# Altium project Project Sunsat PCB.PrjPcb
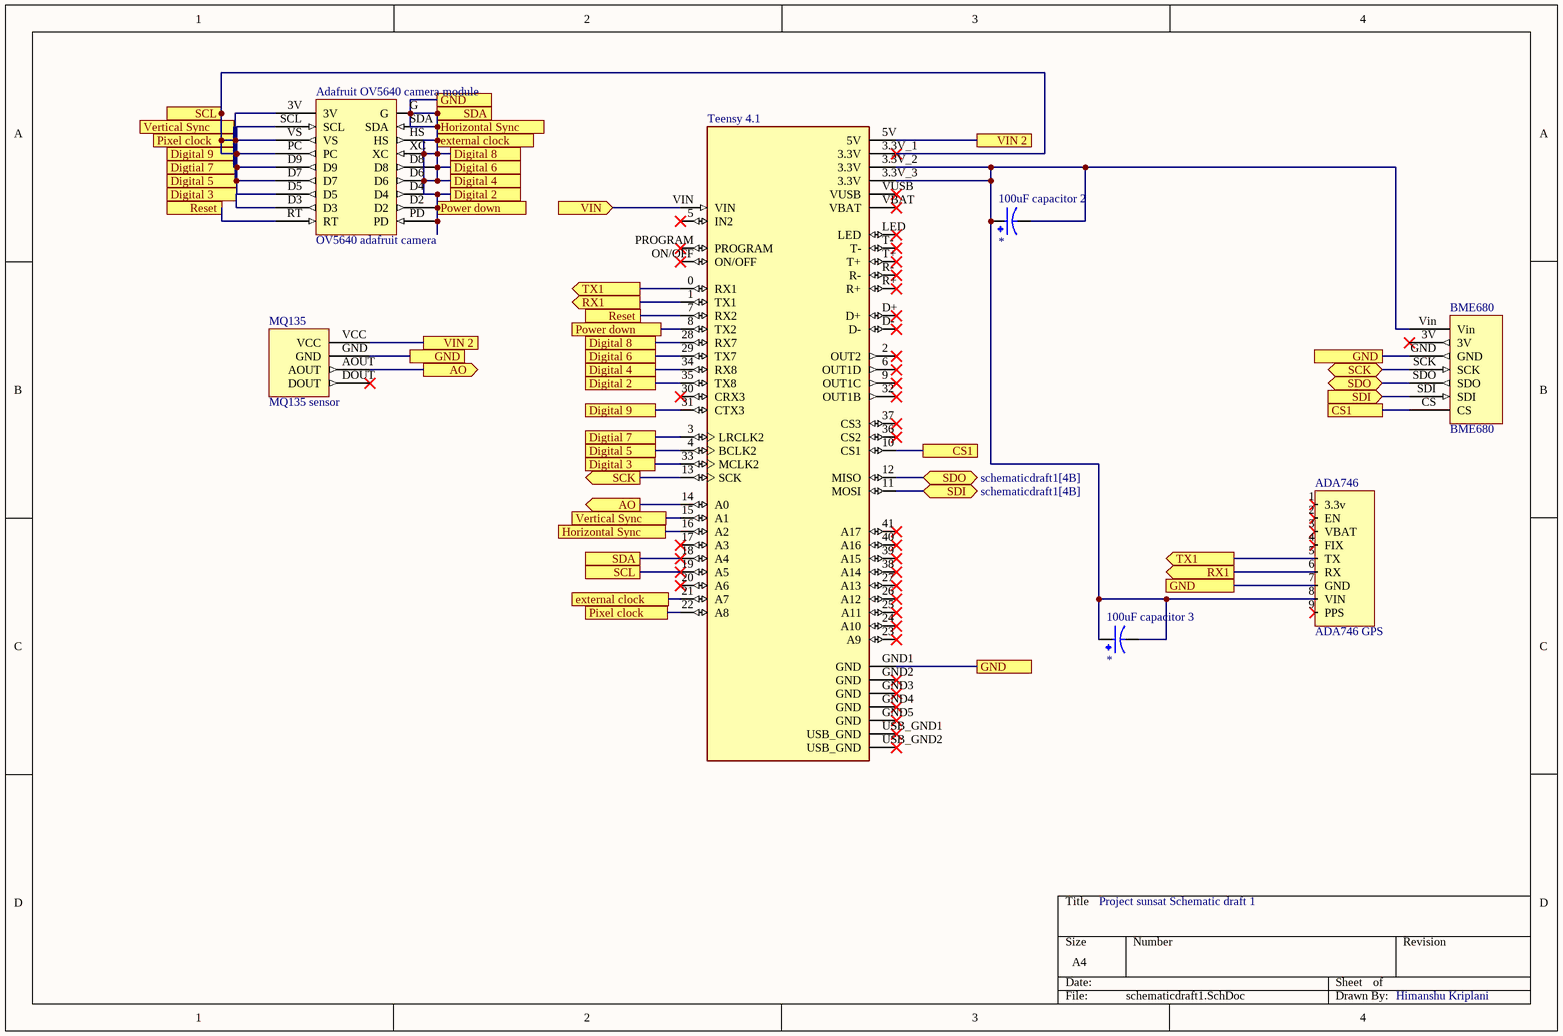
[diagram p0: schematicdraft1.SchDoc]
2 sheets, 11 parts. Net scope: flat (ports and power ports of the same name join across sheets).
Board files: PCBdraft1.PcbDoc, PCBdraft2.PcbDoc
Sheets:
  schematicdraft1.SchDoc
  powercircuitschematicdraft1.SchDoc

## Sheet schematicdraft1.SchDoc
size A4; SheetNumber: 1; SheetTotal: 2

### Parts
100uF_capacitor_2  EEUTA1V101  [CAPPRD500W60D1000H1250]  (value not drawn)
100uF_capacitor_3  EEUTA1V101  [CAPPRD500W60D1000H1250]  (value not drawn)
ADA746  ADA746 GPS  [ADA746 GPS footprint]
Adafruit_OV5640_camera_module  OV5640 adafruit camera  [OV5640 footprint]
BME680  BME680  [BME 680 footprint]
MQ135  MQ135 sensor  [MQ135 footprint]
Teensy_4.1  Teensy 4.1  [MODULE_DEV-16771]  (value not drawn)

### Ports
AO (out, see schematicdraft1[2B]), CS1 (see schematicdraft1[3B]), CS1 (see schematicdraft1[4B]), Digital 2 (see schematicdraft1[2A]), Digital 2 (see schematicdraft1[2B]), Digital 3 (see schematicdraft1[1A]), Digital 3 (see schematicdraft1[2B]), Digital 4 (see schematicdraft1[2A]), Digital 4 (see schematicdraft1[2B]), Digital 5 (see schematicdraft1[1A]), Digital 5 (see schematicdraft1[2B]), Digital 6 (see schematicdraft1[2A]), Digital 6 (see schematicdraft1[2B]), Digital 8 (see schematicdraft1[2A]), Digital 8 (see schematicdraft1[2B]), Digital 9 (see schematicdraft1[1A]), Digital 9 (see schematicdraft1[2B]), Digtial 7 (see schematicdraft1[1A]), Digtial 7 (see schematicdraft1[2B]), external clock (see schematicdraft1[2A]), external clock (see schematicdraft1[2C]), GND (see schematicdraft1[2A], schematicdraft1[2B], schematicdraft1[3C]), GND (see schematicdraft1[2A], schematicdraft1[2B], schematicdraft1[3C], schematicdraft1[4B]), GND (see schematicdraft1[2A], schematicdraft1[3C], schematicdraft1[4B]), GND (see schematicdraft1[2B], schematicdraft1[3C], schematicdraft1[4B]), Horizontal Sync (see schematicdraft1[2A]), Horizontal Sync (see schematicdraft1[2C]), Pixel clock (see schematicdraft1[1A]), Pixel clock (see schematicdraft1[2C]), Power down (see schematicdraft1[2A]), Power down (see schematicdraft1[2B]), Reset (see schematicdraft1[1A]), Reset (see schematicdraft1[2B]), RX1 (out, see schematicdraft1[2B]), RX1 (out, see schematicdraft1[3C]), SCK (bidir, see schematicdraft1[2B]), SCK (out, see schematicdraft1[4B]), SCL (see schematicdraft1[1A]), SCL (see schematicdraft1[2C]), SDA (see schematicdraft1[2A]), SDA (see schematicdraft1[2C]), SDI (bidir, see schematicdraft1[4B]), SDI (in, see schematicdraft1[3B]), SDO (bidir, see schematicdraft1[3B]), SDO (bidir, see schematicdraft1[4B]), TX1 (out, see schematicdraft1[2B]), TX1 (out, see schematicdraft1[3C]), Vertical Sync (see schematicdraft1[1A]), Vertical Sync (see schematicdraft1[2C]), VIN 2 (see schematicdraft1[2B]), VIN 2 (see schematicdraft1[3A]), VIN (in, see powercircuitschematicdraft1[2B])

### Nets
Net5v_voltage_regulator_3: Teensy_4.1.VIN ; port VIN
Net100uF_capacitor_2_N: 100uF_capacitor_2.N 100uF_capacitor_2.P 100uF_capacitor_3.N 100uF_capacitor_3.P ADA746.8(VIN) BME680.Vin Teensy_4.1.3.3V_2(3.3V) Teensy_4.1.3.3V_3(3.3V)
NetADA746_5: ADA746.5(TX) Teensy_4.1.0(RX1) ; port TX1
NetADA746_6: ADA746.6(RX) Teensy_4.1.1(TX1) ; port RX1
NetADA746_7: ADA746.7(GND) Adafruit_OV5640_camera_module.D2 Adafruit_OV5640_camera_module.D4 Adafruit_OV5640_camera_module.D6 Adafruit_OV5640_camera_module.D8 Adafruit_OV5640_camera_module.G Adafruit_OV5640_camera_module.HS Adafruit_OV5640_camera_module.PD Adafruit_OV5640_camera_module.SDA Adafruit_OV5640_camera_module.XC BME680.GND MQ135.GND Teensy_4.1.8(TX2) Teensy_4.1.16(A2) Teensy_4.1.18(A4) Teensy_4.1.21(A7) Teensy_4.1.28(RX7) Teensy_4.1.29(TX7) Teensy_4.1.34(RX8) Teensy_4.1.35(TX8) Teensy_4.1.GND1(GND) ; port GND, port SDA, port Power down, port Digital 8, port Digital 6, port Digital 4, port Digital 2, port Horizontal Sync, port external clock
NetAdafruit_OV5640_camera_module_3V: Adafruit_OV5640_camera_module.3V Adafruit_OV5640_camera_module.D5 Adafruit_OV5640_camera_module.D7 Adafruit_OV5640_camera_module.D9 Adafruit_OV5640_camera_module.PC Adafruit_OV5640_camera_module.SCL Adafruit_OV5640_camera_module.VS Teensy_4.1.3(LRCLK2) Teensy_4.1.3.3V_1(3.3V) Teensy_4.1.4(BCLK2) Teensy_4.1.15(A1) Teensy_4.1.19(A5) Teensy_4.1.22(A8) Teensy_4.1.31(CTX3) ; port SCL, port Digital 5, port Digtial 7, port Digital 9, port Vertical Sync, port Pixel clock
NetAdafruit_OV5640_camera_module_D3: Adafruit_OV5640_camera_module.D3 Teensy_4.1.33(MCLK2) ; port Digital 3
NetAdafruit_OV5640_camera_module_RT: Adafruit_OV5640_camera_module.RT Teensy_4.1.7(RX2) ; port Reset
NetBME680_CS: BME680.CS Teensy_4.1.10(CS1) ; port CS1
NetBME680_SCK: BME680.SCK Teensy_4.1.13(SCK) ; port SCK
NetBME680_SDI: BME680.SDI Teensy_4.1.11(MOSI) ; port SDI
NetBME680_SDO: BME680.SDO Teensy_4.1.12(MISO) ; port SDO
NetMQ135_AOUT: MQ135.AOUT Teensy_4.1.14(A0) ; port AO
NetMQ135_VCC: MQ135.VCC Teensy_4.1.5V ; port VIN 2

Not connected (* = marked no-connect by the designer): ADA746 1(3.3v)* 2(EN)* 3(VBAT)* 4(FIX)* 9(PPS)*; BME680 3V(3V_)*; MQ135 DOUT*; Teensy_4.1 2(OUT2)* 5(IN2)* 6(OUT1D)* 9(OUT1C)* 17(A3)* 20(A6)* 23(A9)* 24(A10)* 25(A11)* 26(A12)* 27(A13)* 30(CRX3)* 32(OUT1B)* 36(CS2)* 37(CS3)* 38(A14)* 39(A15)* 40(A16)* 41(A17)* D+* D-* GND2(GND)* GND3(GND)* GND4(GND)* GND5(GND)* LED* ON/OFF* PROGRAM* R+* R-* T+* T-* USB_GND1(USB_GND)* USB_GND2(USB_GND)* VBAT* VUSB*

### Notes on the sheet
- Project sunsat Schematic draft 1
- Himanshu Kriplani

### Library data of the parts
100uF_capacitor_2 100uF_capacitor_3 = CMP-007-000000-1: CAP ALUM 100UF 20% 35V RADIAL; MF: Panasonic; Package: RADIAL-2 Panasonic; SnapEDA_Link: https://www.snapeda.com/parts/EEUTA1V101/Panasonic/view-part/5783936/?ref=snap; Availability: In Stock; Source: EEUTA1V101.SchLib; Component Type: Standard; MP: EEUTA1V101; Check_prices: https://www.snapeda.com/parts/EEUTA1V101/Panasonic/view-part/5783936/?ref=eda; Pin Count: 2; Value: *; Price: None; Design Item ID: EEUTA1V101
ADA746 = CMP-010-00025-3: I created this library because I didnot find an existing one
Adafruit_OV5640_camera_module = CMP-010-00028-3: Adafruit OV5640 camera
BME680 = CMP-010-00024-6: Temperature and pressure sensor
MQ135 = CMP-010-00026-3: New schematic and footprint for the MQ135 CO2 sensor
Teensy_4.1 = CMP-003-000000-1: RT1062 Teensy 4.1 series ARMÂ® CortexÂ®-M7 MPU Embedded Evaluation Board; MF: SparkFun Electronics; MP: DEV-16771; Package: None; Component Type: Standard; Pin Count: 65; Purchase-URL: https://pricing.snapeda.com/search/part/DEV-16771/?ref=eda; SnapEDA_Link: https://www.snapeda.com/parts/DEV-16771/SparkFun+Electronics/view-part/?ref=snap; Availability: In Stock; Source: DEV-16771.SchLib; Design Item ID: DEV-16771; Check_prices: https://www.snapeda.com/parts/DEV-16771/SparkFun+Electronics/view-part/?ref=eda; Value: *; Price: None

## Sheet powercircuitschematicdraft1.SchDoc
size A4; SheetNumber: 1; SheetTotal: 2
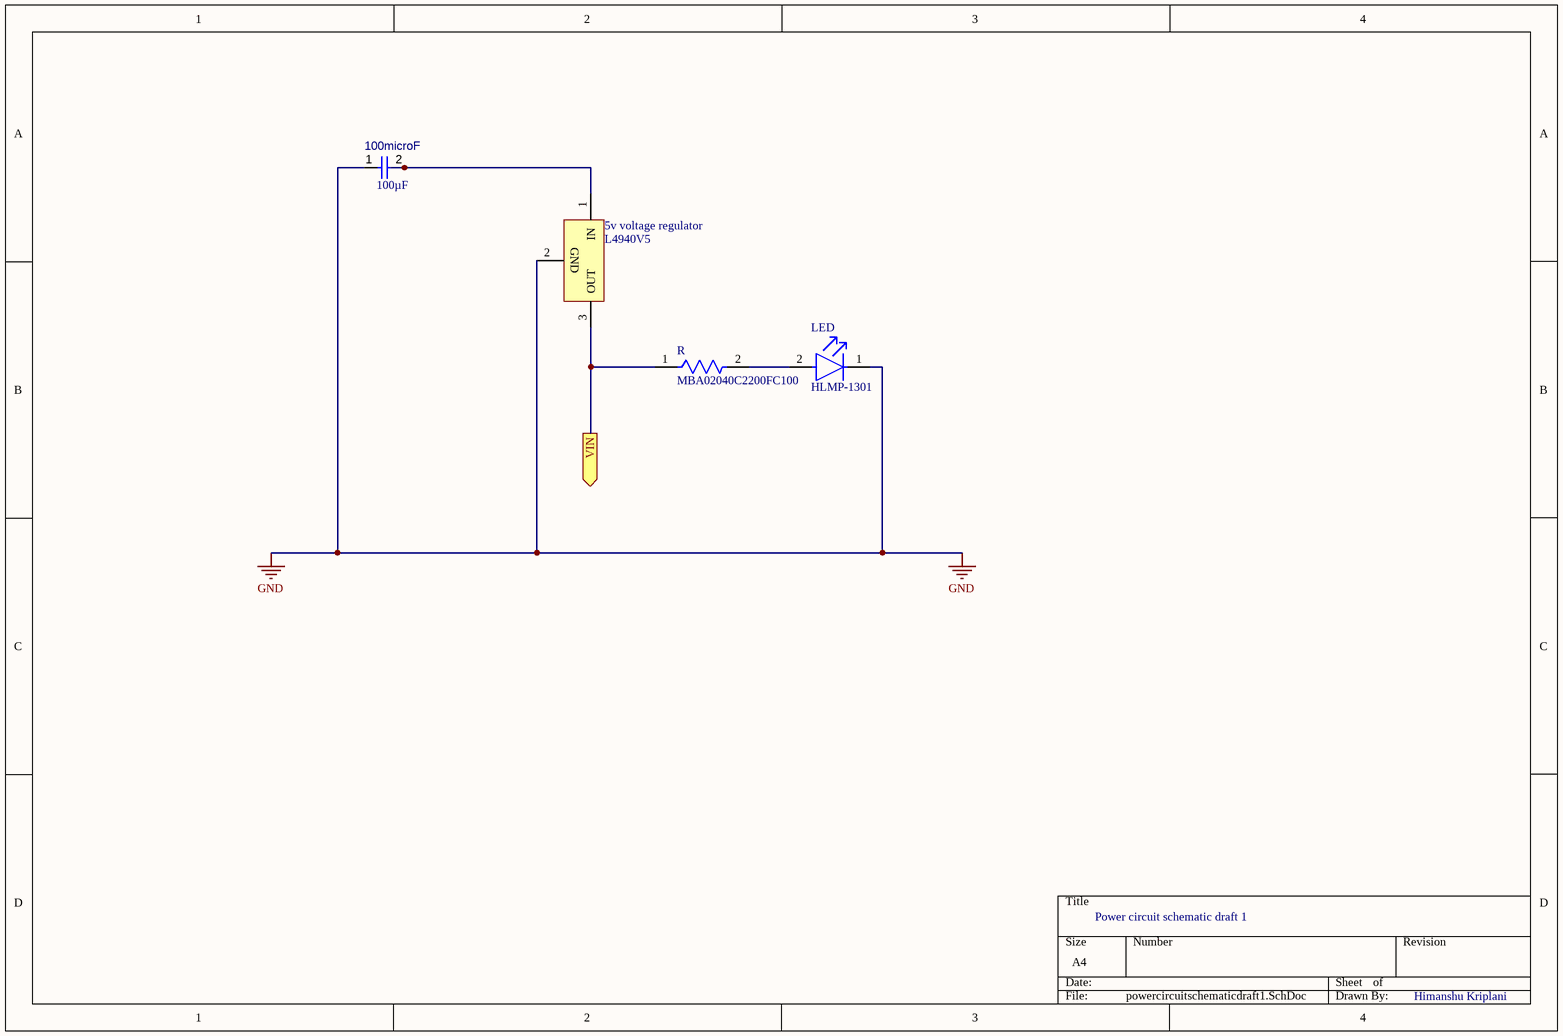
[diagram p1: powercircuitschematicdraft1.SchDoc]

### Parts
5v_voltage_regulator  L4940V5  [TO220]
100microF  value 100µF  [CAPC0805(2012)145_L]  (hidden comment: Capacitor 100µF +/-20% 6.3V 0805)
LED  HLMP-1301  [FP-HLMP-1301-MFG]
R  MBA02040C2200FC100  [FP-MBA0204-MFG]

### Ports
VIN (out)

### Nets
GND: 5v_voltage_regulator.2(GND) 100microF.1 LED.1(C)
Net5v_voltage_regulator_1: 5v_voltage_regulator.1(IN) 100microF.2
Net5v_voltage_regulator_3: 5v_voltage_regulator.3(OUT) R.1 ; port VIN
NetLED_2: LED.2(A) R.2

### Notes on the sheet
- Power circuit schematic draft 1
- Himanshu Kriplani

### Library data of the parts
5v_voltage_regulator = CMP-0244-00429-1: 1.5A Very Low Drop Regulator, 3-Pin TO-220; PackageReference: TO220; PackageDescription: TO, Thru-Hole, Vertical, Heatsink Mounted; 3 In-Line Leads; Pitch 2.54 mm; ComponentLink1Description: Manufacturer URL; ComponentLink1URL: http://www.st.com; ComponentLink2Description: Datasheet; DatasheetVersion: 16/12/2009; ComponentLink2URL: http://www.st.com/internet/com/TECHNICAL_RESOURCES/TECHNICAL_LITERATURE/DATASHEET/CD00000442.pdf; ComponentLink3URL: http://www.st.com/internet/com/TECHNICAL_RESOURCES/TECHNICAL_LITERATURE/PACKAGE_INFORMATION/CD00004649.pdf; PackageVersion: ver3.0; ComponentLink3Description: Package Specification
100microF = CMP-001-00054-4: Chip Capacitor, 100µF +/-20%, 6.3V, 0805, Thickness 1.45 mm; Tolerance: 10%; Min Operating Temperature: -55°C; Max Operating Temperature: 85°C; Pins: 2; Mounting Technology: SMT; Case/Package: 0805; Voltage Rating: 6.3V
LED = CMP-18399-000007-1: LED RED DIFFUSED T-1 T/H; Manufacturer: Broadcom; Forward Current: 10mA; Max Junction Temp: +110°C; Wavelength: 626nm; Led Orientation: Straight; Viewing Angle: 60°; Luminous Intensity: 3.4mcd; Forward Voltage: 1.9V; Reverse Voltage: 5V; Peak Emmision Wavelength: 635nm; Mouser Description: Standard LEDs - Through Hole Red Diffused 635nm 3.4mcd; RoHS: TRUE; ComponentLink2Description: Datasheet; Device Class L1: Optoelectronics; Temperature Range High: +100°C; Manufacturer Part Number: HLMP-1301; ComponentLink2URL: https://docs.broadcom.com/docs/AV02-1555EN; Colour: Red; Digikey Description: LED RED DIFFUSED T-1 T/H; Automotive: No; Device Class L2: LEDs; Temperature Range Low: -40°C; Octopart: https://octopart.com/hlmp-1301-broadcom-71130345; Category: Diode; Lead Free: Yes; Device Class L3: unset; Package: 0; Temperature: -40°C to +100°C
R = CMP-02408-000005-1: RES 220 OHM 0.4W 1% AXIAL; Manufacturer: Vishay BC Components; Automotive Grade: Grade 1; Value: 220Ω; Voltage Rating: 200V; Temperature Coefficient: 50ppm/°C; Power Rating: 0.25W; Digikey Description: RES 220 OHM 0.4W 1% AXIAL; Height: 1.6mm; Automotive: Yes; Lead Free: Yes; Mouser Description: Thin Film Resistors - Through Hole .4watt 220ohms 1% 1/8watt body size; Temperature Range Low: -55°C; ComponentLink2Description: Datasheet; Temperature: -55°C to +125°C; Device Class L3: Through-Hole Resistors; Manufacturer Part Number: MBA02040C2200FC100; Ipc Land Pattern Name: RESAD500W65L360D160; Octopart: https://octopart.com/mba02040c2200fc100-vishay-43743094; Series: MBA/SMA 0204; RoHS: TRUE; Tolerance: 1%; Package: MBA0204; Device Class L1: Passive Components; ComponentLink2URL: http://www.vishay.com/docs/28766/mbxsma.pdf; Category: Res; Composition: Metal Film; Device Class L2: Resistors; Temperature Range High: +125°C; Resistance: 220Ω

## Nets that join several sheets
Net5v_voltage_regulator_3: schematicdraft1 (Teensy_4.1.VIN), powercircuitschematicdraft1 (5v_voltage_regulator.3 R.1)